# Altium schematic sheet PowerSupply.SchDoc: PowerSupply
size A3; Author: Martín Ramírez Espinosa; Revision: 1.0; SheetNumber: 3; SheetTotal: 3
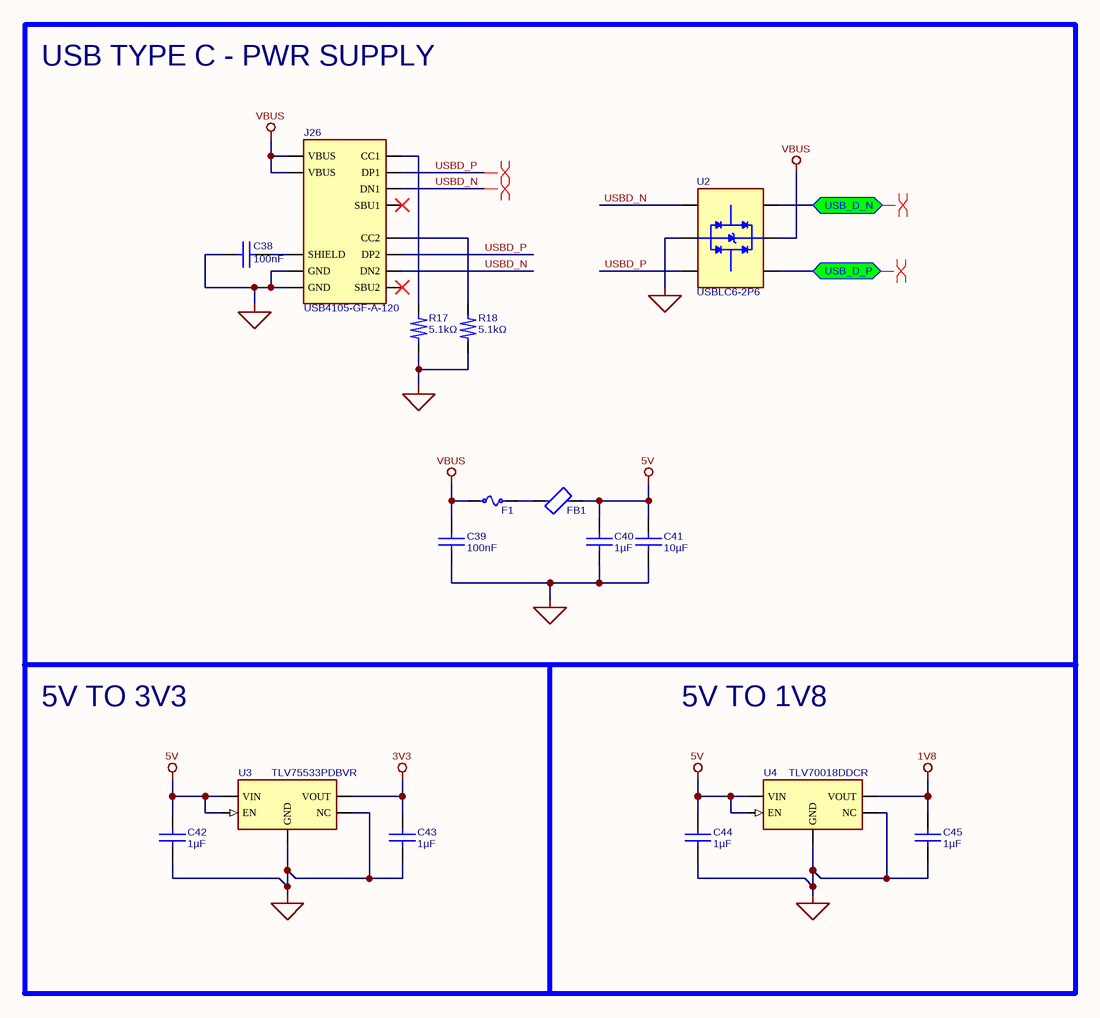
[diagram p0: PowerSupply.SchDoc]

## Parts
C38  value 100nF  [CAPC2012]  (hidden comment: CC0805KRX7R9BB104)
C39  value 100nF  [CAPC2012]  (hidden comment: CC0805KRX7R9BB104)
C40  value 1µF  [CAPC2012]  (hidden comment: CL21B105KBFNNNE)
C41  value 10µF  [CAPC3216]  (hidden comment: C3216X5R1C106K160AA)
C42  value 1µF  [CAPC2012]  (hidden comment: CL21B105KBFNNNE)
C43  value 1µF  [CAPC2012]  (hidden comment: CL21B105KBFNNNE)
C44  value 1µF  [CAPC2012]  (hidden comment: CL21B105KBFNNNE)
C45  value 1µF  [CAPC2012]  (hidden comment: CL21B105KBFNNNE)
F1  0467002.NR  [FUSC1608X31N]  (value not drawn)
FB1  BLM21PG221SN1D  [FP-BLM21-0_2-t0_85-e0_5-MFG]  (value not drawn)
J26  USB4105-GF-A-120  [GCT_USB4105-GF-A-120]
R17  value 5.1kΩ  [RESC1608]  (hidden comment: RC0603FR-075K1L)
R18  value 5.1kΩ  [RESC1608]  (hidden comment: RC0603FR-075K1L)
U2  USBLC6-2P6  [SOT50P160X60-6N]
U3  TLV75533PDBVR  [SOT95P280X110-5N]
U4  TLV70018DDCR  [SOT95P280X110-5N]

## Ports
USB_D_N (bidir, see AudioLab[3C]), USB_D_P (bidir, see AudioLab[3C])

## Nets
1V8: C45.1 U4.5(VOUT)
3V3: C43.1 U3.5(VOUT)
5V: C40.1 C41.1 C42.1 C44.1 FB1.2 U3.1(VIN) U3.3(EN) U4.1(VIN) U4.3(EN)
GND: C38.1 C39.1 C40.2 C41.2 C42.2 C43.2 C44.2 C45.2 J26.A1_B12(GND) J26.B1_A12(GND) R17.1 R18.1 U2.2(GND) U3.2(GND) U3.4(NC) U4.2(GND) U4.4(NC)
VBUS: C39.2 F1.2 J26.A4_B9(VBUS) J26.B4_A9(VBUS) U2.5(VBUS)
USB_D_N: U2.6(I/O1_2) ; port USB_D_N
USB_D_P: U2.4(I/O2_2) ; port USB_D_P
USBD_N: J26.A7(DN1) J26.B7(DN2) U2.1(I/O1_1)
USBD_P: J26.A6(DP1) J26.B6(DP2) U2.3(I/O2_1)
NetC38_2: C38.2 J26.SH(SHIELD)
NetF1_1: F1.1 FB1.1
NetJ26_A5: J26.A5(CC1) R17.2
NetJ26_B5: J26.B5(CC2) R18.2

Not connected (* = marked no-connect by the designer): J26 A8(SBU1)* B8(SBU2)*

## Layout directives
differential pair: USB_D_N, USB_D_P, USBD_N, USBD_P

## Notes on the sheet
- USB TYPE C - PWR SUPPLY
- 5V TO 3V3
- 5V TO 1V8

## Library data of the parts
C38 C39 = CC0805KRX7R9BB104: 50V 100nF X7R ±10% 0805 Multilayer Ceramic Capacitors MLCC - SMD/SMT ROHS; Manufacturer: YAGEO; Supplier: DigiKey; Supplier Part Number: 311-1140-1-ND; Manufacturer Part Number: CC0805KRX7R9BB104; Package/Case: 0805 (2012 Metric)
C40 C42-C45 = CL21B105KBFNNNE: 50V 1uF X7R ±10% 0805 Multilayer Ceramic Capacitors MLCC - SMD/SMT ROHS; Manufacturer: Samsung Electro-Mechanics; Supplier: DigiKey; Supplier Part Number: 1276-1029-1-ND; Manufacturer Part Number: CL21B105KBFNNNE; Package/Case: 0805 (2012 Metric)
C41 = C3216X5R1C106K160AA: Multilayer Ceramic Capacitors MLCC – SMD/SMT; TDK; C3216X5R1C106K160AA; 10 µF; 1206; 16 V; 16 V; Supplier: DigiKey; Supplier Part Number: 445-4052-1-ND; Manufacturer: TDK; Manufacturer Part Number: C3216X5R1C106K160AA; Package/Case: 1206 (3216 Metric)
F1 = 0467002.NR: Electric Fuse, Very Fast Blow, 2A, 32VAC, 32VDC, 35A (IR), Surface Mount, 0603; Manufacturer: Littelfuse Inc; Supplier: DigiKey; Supplier Part Number: F1397CT-ND; Manufacturer Part Number: 0467002.NR; Package/Case: 0603 (1608 Metric); Value: *
FB1 = BLM21PG221SN1D: 220 Ohms @ 100 MHz 1 Power Line Ferrite Bead 0805 (2012 Metric) 2A 45mOhm; Manufacturer: Murata Electronics; Value: *; Supplier: DigiKey; Supplier Part Number: 490-1054-1-ND; Manufacturer Part Number: BLM21PG221SN1D; Package/Case: 0805 (2012 Metric)
J26 = USB4105-GF-A-120: USB Connector, 24 Contact(s), Female, Right Angle, Solder Terminal, Locking, Receptacle; Manufacturer: GCT; Value: *; Manufacturer Part Number: USB4105-GF-A-120; Supplier: DigiKey; Supplier Part Number: 2073-USB4105-GF-A-120CT-ND; Package/Case: CT
R17 R18 = RC0603FR-075K1L: Res Thick Film 0603 5.1K Ohm 1% 0.1W(1/10W) ±100ppm/C Pad SMD T/R; Manufacturer: YAGEO; Supplier: DigiKey; Supplier Part Number: 311-5.10KHRCT-ND; Manufacturer Part Number: RC0603FR-075K1L; Package/Case: 0603 (1608 Metric)
U2 = USBLC6-2P6: Tvs Diodes & Esd Suppressors; USBLC6-2P6; Stmicroelectronics; 5 V; 17 V; 6 V; 6 V; Value: *; Manufacturer Part Number: USBLC6-2P6; Manufacturer: STMicroelectronics; Supplier Part Number: 497-5026-1-ND; Supplier: DigiKey; Package/Case: SOT-666
U3 = TLV75533PDBVR: 500mA high-PSRR low-IQ low-dropout voltage regulator with enable 5-SOT-23 -40 to 125; Manufacturer: Texas Instruments; Value: *; Supplier: DigiKey; Supplier Part Number: 296-50411-1-ND; Manufacturer Part Number: TLV75533PDBVR; Package/Case: SOT-23-5
U4 = TLV70018DDCR: 200-mA, high-PSRR, low-IQ, low-dropout voltage regulator with enable 5-SOT-23-THIN -40 to 125; Manufacturer: Texas Instruments; Value: *; Manufacturer Part Number: TLV70018DDCR; Supplier Part Number: 296-32410-1-ND; Supplier: DigiKey; Package/Case: SOT-23-5